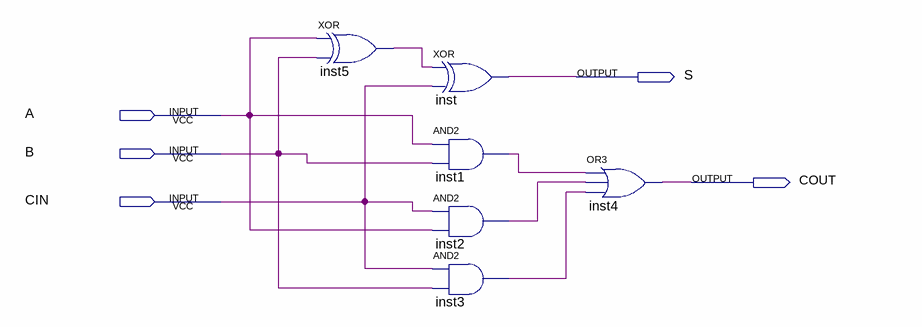
[diagram p0: schematic sheet]
// Quartus schematic FA.bdf as structural Verilog: 6 symbols, 5 pins
module FA (
  input  A,
  input  B,
  input  CIN,
  output S,
  output COUT
);

  wire inst1_out, inst2_out, inst3_out, inst5_out;

  xor inst5 (inst5_out, A, B);
  xor inst (S, inst5_out, CIN);
  and inst1 (inst1_out, A, B);
  and inst2 (inst2_out, CIN, A);
  and inst3 (inst3_out, CIN, B);
  or inst4 (COUT, inst1_out, inst2_out, inst3_out);
endmodule
